# Altium project MDQARM.PrjPcb
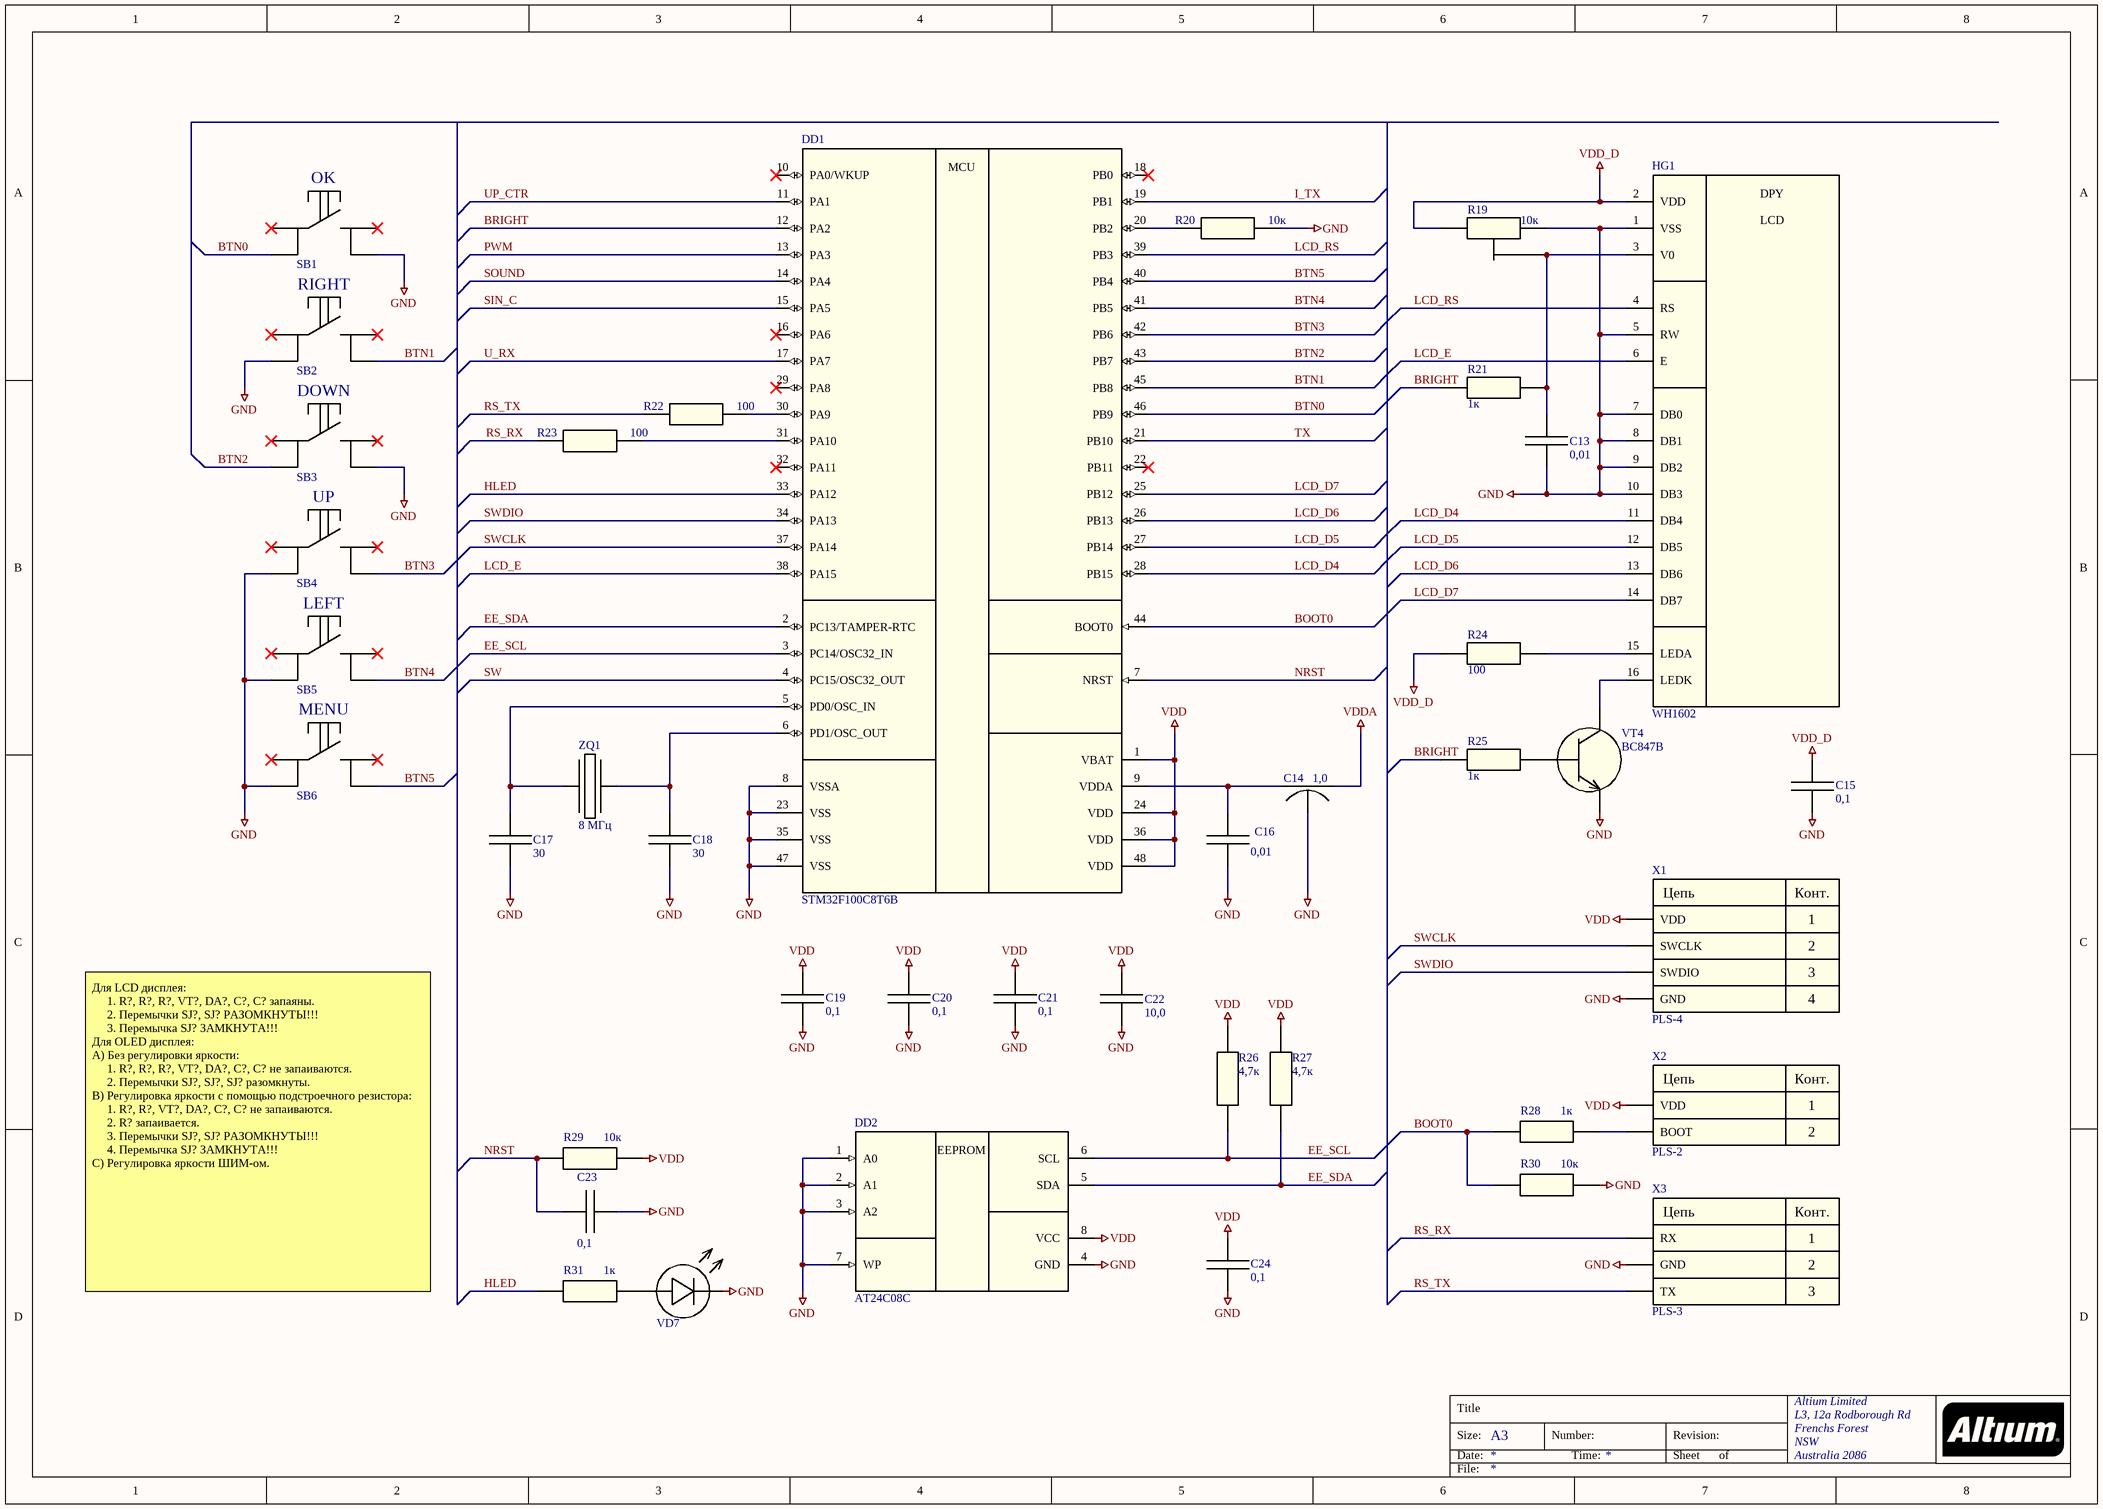
[diagram p0: MDQARM_MCU.SchDoc]
5 sheets, 171 parts. Net scope: global (net labels, ports and power ports of the same name join across sheets).
Board file: MDQARM.PcbDoc
Sheets:
  MDQARM_MCU.SchDoc
  MDQARM_COIL.SchDoc
  MDQARM_SOUND.SchDoc
  MDQARM_USB_UART.SchDoc
  MDQARM_POWER.SchDoc

## Sheet MDQARM_MCU.SchDoc
size A3; Organization: Altium Limited; Address1: L3, 12a Rodborough Rd; Address2: Frenchs Forest; Address3: NSW; Address4: Australia 2086

### Parts
C13  0,01  [Capacitor SMD0805-T0.75]
C14  1,0  [Filter NFM21PC]
C15  0,1  [Capacitor SMD0805-T0.95]
C16  0,01  [Capacitor SMD0805-T0.75]
C17  30  [Capacitor SMD0805-T0.75]
C18  30  [Capacitor SMD0805-T0.75]
C19  0,1  [Capacitor SMD0805-T0.95]
C20  0,1  [Capacitor SMD0805-T0.95]
C21  0,1  [Capacitor SMD0805-T0.95]
C22  10,0  [Capacitor SMD0805-T1.35]
C23  0,1  [Capacitor SMD0805-T0.95]
C24  0,1  [Capacitor SMD0805-T0.95]
DD1  STM32F100C8T6B  [IC STM32F100C8T6B]
DD2  AT24C08C  [IC AT24C08C]
HG1  WH1602  [Indicator WH1602]
R19  10к  [Resistor 3303X-3]
R20  10к  [Resistor SMD0805]
R21  1к  [Resistor SMD0805]
R22  100  [Resistor SMD0805]
R23  100  [Resistor SMD0805]
R24  100  [Resistor SMD0805]
R25  1к  [Resistor SMD0805]
R26  4,7к  [Resistor SMD0805]
R27  4,7к  [Resistor SMD0805]
R28  1к  [Resistor SMD0805]
R29  10к  [Resistor SMD0805]
R30  10к  [Resistor SMD0805]
R31  1к  [Resistor SMD0805]
SB1  KLS7-TS6604-4.3-180  [Button KLS7-TS6604-4.3-180]  (value not drawn)
SB2  KLS7-TS6604-4.3-180  [Button KLS7-TS6604-4.3-180]  (value not drawn)
SB3  KLS7-TS6604-4.3-180  [Button KLS7-TS6604-4.3-180]  (value not drawn)
SB4  KLS7-TS6604-4.3-180  [Button KLS7-TS6604-4.3-180]  (value not drawn)
SB5  KLS7-TS6604-4.3-180  [Button KLS7-TS6604-4.3-180]  (value not drawn)
SB6  KLS7-TS6604-4.3-180  [Button KLS7-TS6604-4.3-180]  (value not drawn)
VD7  RED  [Diode SMD0805]  (value not drawn)
VT4  BC847B  [Transistor SOT23]
X1  PLS-4  [Connector PLS-4]
X2  PLS-2  [Connector PLS-2]
X3  PLS-3  [Connector PLS-3]
ZQ1  8 МГц  [Quartz HC-49SM]

### Nets
GND: C13.1 C14.2 C15.1 C16.1 C17.1 C18.1 C19.1 C20.1 C21.1 C22.1 C23.2 C24.1 DD1.8(VSSA) DD1.23(VSS) DD1.35(VSS) DD1.47(VSS) DD2.1(A0) DD2.2(A1) DD2.3(A2) DD2.4(GND) DD2.7(WP) HG1.1(VSS) HG1.5(RW) HG1.7(DB0) HG1.8(DB1) HG1.9(DB2) HG1.10(DB3) R19.3 R20.2 R30.2 SB1.3 SB2.2 SB3.3 SB4.2 SB5.2 SB6.2 VD7.2(C) VT4.2(E) X1.4(GND) X3.2(GND)
VDD: C19.2 C20.2 C21.2 C22.2 C24.2 DD1.1(VBAT) DD1.24(VDD) DD1.36(VDD) DD1.48(VDD) DD2.8(VCC) R26.2 R27.2 R29.2 X1.1(VDD) X2.1(VDD)
VDD_D: C15.2 HG1.2(VDD) R19.1 R24.2
VDDA: C14.3
BOOT0: DD1.44(BOOT0) R28.1 R30.1
BRIGHT: DD1.12(PA2) R21.1 R25.2
BTN0: DD1.46(PB9) SB1.2
BTN1: DD1.45(PB8) SB2.3
BTN2: DD1.43(PB7) SB3.2
BTN3: DD1.42(PB6) SB4.3
BTN4: DD1.41(PB5) SB5.3
BTN5: DD1.40(PB4) SB6.3
EE_SCL: DD1.3(PC14/OSC32_IN) DD2.6(SCL) R26.1
EE_SDA: DD1.2(PC13/TAMPER-RTC) DD2.5(SDA) R27.1
HLED: DD1.33(PA12) R31.1
I_TX: DD1.19(PB1)
LCD_D4: DD1.28(PB15) HG1.11(DB4)
LCD_D5: DD1.27(PB14) HG1.12(DB5)
LCD_D6: DD1.26(PB13) HG1.13(DB6)
LCD_D7: DD1.25(PB12) HG1.14(DB7)
LCD_E: DD1.38(PA15) HG1.6(E)
LCD_RS: DD1.39(PB3) HG1.4(RS)
NRST: C23.1 DD1.7(NRST) R29.1
PWM: DD1.13(PA3)
RS_RX: R23.1 X3.1(RX)
RS_TX: R22.1 X3.3(TX)
SIN_C: DD1.15(PA5)
SOUND: DD1.14(PA4)
SW: DD1.4(PC15/OSC32_OUT)
SWCLK: DD1.37(PA14) X1.2(SWCLK)
SWDIO: DD1.34(PA13) X1.3(SWDIO)
TX: DD1.21(PB10)
U_RX: DD1.17(PA7)
UP_CTR: DD1.11(PA1)
NetC13_2: C13.2 HG1.3(V0) R19.2 R21.2
NetC14_1: C14.1 C16.2 DD1.9(VDDA)
NetC17_2: C17.2 DD1.5(PD0/OSC_IN) ZQ1.1
NetC18_2: C18.2 DD1.6(PD1/OSC_OUT) ZQ1.2
NetDD1_20: DD1.20(PB2) R20.1
NetDD1_30: DD1.30(PA9) R22.2
NetDD1_31: DD1.31(PA10) R23.2
NetHG1_15: HG1.15(LEDA) R24.1
NetHG1_16: HG1.16(LEDK) VT4.3(C)
NetR25_1: R25.1 VT4.1(B)
NetR28_2: R28.2 X2.2(BOOT)
NetR31_2: R31.2 VD7.1(A)

Not connected (* = marked no-connect by the designer): DD1 10(PA0/WKUP)* 16(PA6)* 18(PB0)* 22(PB11)* 29(PA8)* 32(PA11)*; SB1 1* 4*; SB2 1* 4*; SB3 1* 4*; SB4 1* 4*; SB5 1* 4*; SB6 1* 4*

### Notes on the sheet
- (near SB1) OK
- (near SB1) RIGHT
- (near SB2) DOWN
- (near SB3) UP
- (near SB4) LEFT
- (near SB5) MENU
- Для LCD дисплея:
  1. R?, R?, R?, VT?, DA?, C?, C? запаяны.
  2. Перемычки SJ?, SJ? РАЗОМКНУТЫ!!!
  3. Перемычка SJ? ЗАМКНУТА!!!
  Для OLED дисплея:
  A) Без регулировки яркости:
  1. R?, R?, R?, VT?, DA?, C?, C? не запаиваются.
  2. Перемычки SJ?, SJ?, SJ? разомкнуты.
  B) Регулировка яркости с помощью подстроечного резистора:
  1. R?, R?, VT?, DA?, C?, C? не запаиваются.
  2. R? запаивается.
  3. Перемычки SJ?, SJ? РАЗОМКНУТЫ!!!
  4. Перемычка SJ? ЗАМКНУТА!!!
  C) Регулировка яркости ШИМ-ом.
- Title
- Size:
- Date:
- A3
- Number:
- Time:
- Revision:
- Sheet
- of
- File:
- (in symbol Connector BOOT) Цепь; Конт.
- (in symbol Connector SWD) Цепь; Конт.
- (in symbol Connector UART) Цепь; Конт.
- (in symbol IC AT24C08C) EEPROM
- (in symbol IC STM32F100C8T6B) MCU
- (in symbol Indicator WH1602) DPY; LCD

### Library data of the parts
C13 C16 = Capacitor C0805_10n: Value: 0,01
C14 = Filter NFM21PC105B1С3D: Value: 1,0
C15 C19-C21 C23 C24 = Capacitor C0805_100n: Value: 0,1
C17 C18 = Capacitor C0805_30p: Value: 30
C22 = Capacitor C0805_10u: Value: 10,0
DD1 = IC STM32F100C8T6B: Value: STM32F100C8T6B
DD2 = IC AT24C08C: Value: AT24C08C
HG1 = Indicator WH1602: Value: WH1602
R19 = Resistor 3303X-3-103_10k_25%: Value: 10к
R20 R29 R30 = Resistor R0805_10k_5%: Value: 10к
R21 R25 R28 R31 = Resistor R0805_1k_5%: Value: 1к
R22-R24 = Resistor R0805_100_5%: Value: 100
R26 R27 = Resistor R0805_4.7k_5%: Value: 4,7к
SB1-SB6 = Button KLS7-TS6604-4.3-180: SMD Tact Switch 4.3mm; Value: KLS7-TS6604-4.3-180
VD7 = Diode LED0805RED: LED Red SMD0805
VT4 = Transistor BC847B: Value: BC847B
X1 = Connector SWD: PLS-4 Connector
X2 = Connector BOOT: PLS-2 Connector
X3 = Connector UART: PLS-3 Connector
ZQ1 = Quartz HC-49SM-8MHz: Value: HC-49SM-8MHz

## Sheet MDQARM_COIL.SchDoc
size A3; Organization: Altium Limited; Address1: L3, 12a Rodborough Rd; Address2: Frenchs Forest; Address3: NSW; Address4: Australia 2086
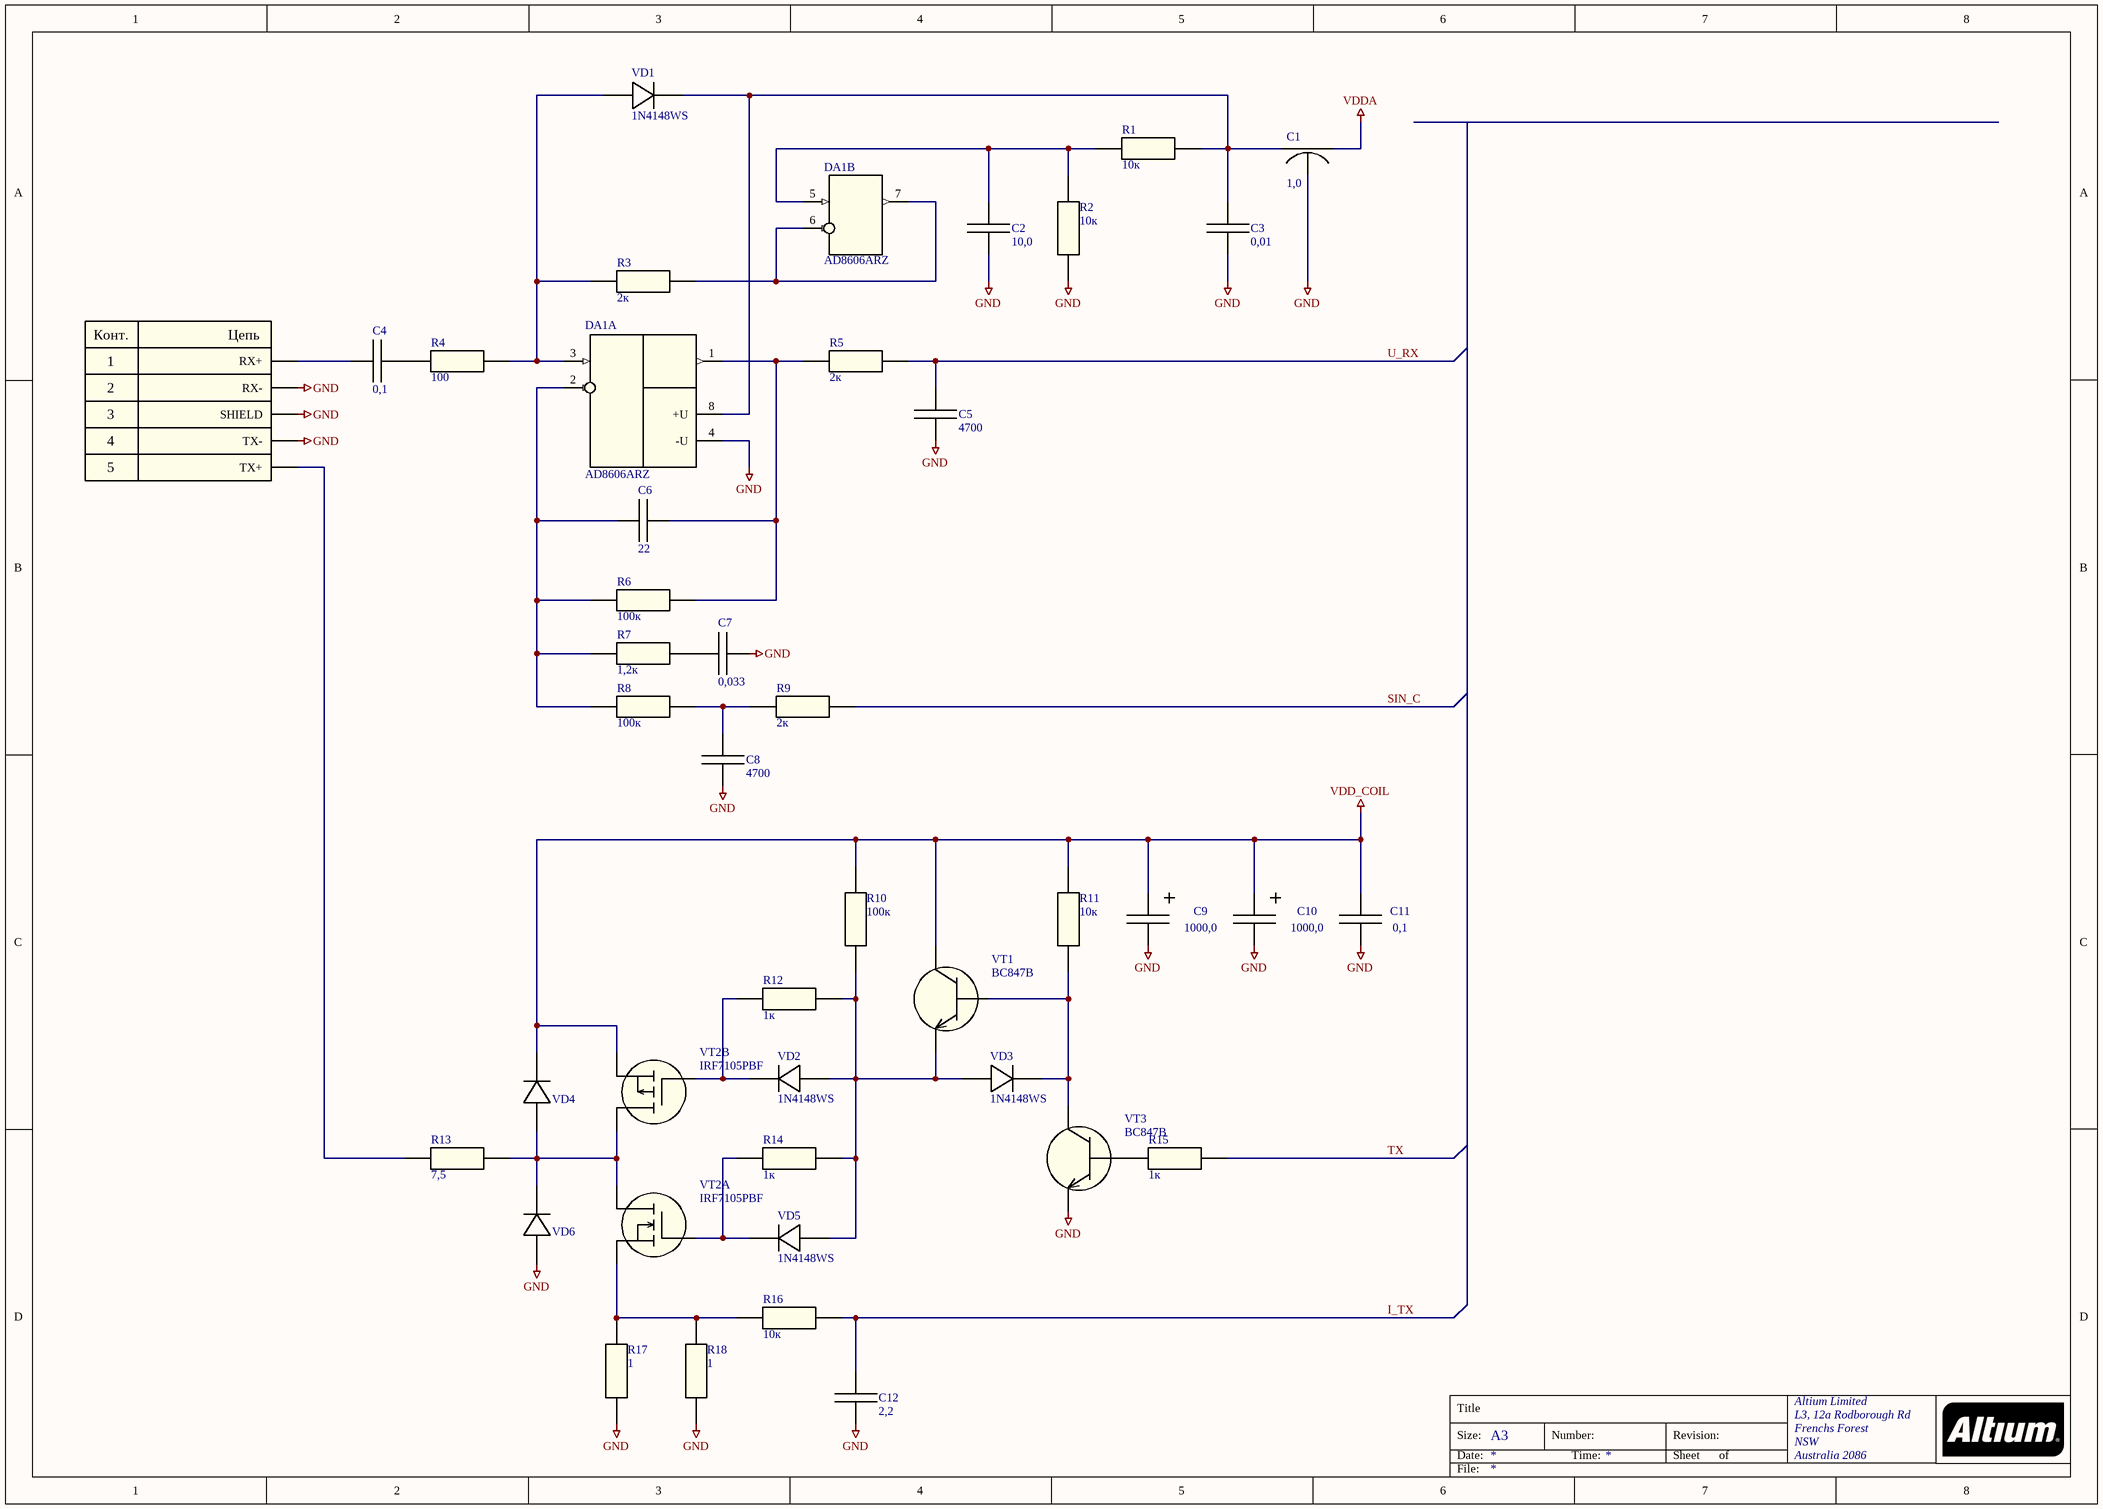
[diagram p1: MDQARM_COIL.SchDoc]

### Parts
*1  Connector MD_COIL  [Connector MD_COIL]  (value not drawn)
C1  1,0  [Filter NFM21PC]
C2  10,0  [Capacitor SMD0805-T1.35]
C3  0,01  [Capacitor SMD0805-T0.75]
C4  0,1  [Capacitor SMD0805_5mm]
C5  4700  [Capacitor SMD0805-T0.75]
C6  22  [Capacitor SMD0805-T0.75]
C7  0,033  [Capacitor SMD0805_5mm]
C8  4700  [Capacitor SMD0805-T0.75]
C9  1000,0  [Capacitor ECAP SMD10x10.5]
C10  1000,0  [Capacitor ECAP SMD10x10.5]
C11  0,1  [Capacitor SMD0805-T0.95]
C12  2,2  [Capacitor SMD0805-T1.35]
DA1  AD8606ARZ  [IC AD8606ARZ]  (parts A,B of 2)
R1  10к  [Resistor SMD0805]
R2  10к  [Resistor SMD0805]
R3  2к  [Resistor SMD0805]
R4  100  [Resistor SMD0805]
R5  2к  [Resistor SMD0805]
R6  100к  [Resistor SMD0805]
R7  1,2к  [Resistor SMD0805]
R8  100к  [Resistor SMD0805]
R9  2к  [Resistor SMD0805]
R10  100к  [Resistor SMD0805]
R11  10к  [Resistor SMD0805]
R12  1к  [Resistor SMD0805]
R13  7,5  [Resistor SMD2512]
R14  1к  [Resistor SMD0805]
R15  1к  [Resistor SMD0805]
R16  10к  [Resistor SMD0805]
R17  1  [Resistor SMD1206]
R18  1  [Resistor SMD1206]
VD1  1N4148WS  [Diode SOD-323]
VD2  1N4148WS  [Diode SOD-323]
VD3  1N4148WS  [Diode SOD-323]
VD4  ES1J  [Diode SMA]  (value not drawn)
VD5  1N4148WS  [Diode SOD-323]
VD6  ES1J  [Diode SMA]  (value not drawn)
VT1  BC847B  [Transistor SOT23]
VT2  IRF7105PBF  [Transisror IRF7105]  (parts A,B of 2)
VT3  BC847B  [Transistor SOT23]

### Nets
GND: *1.2(RX-) *1.3(SHIELD) *1.4(TX-) C1.2 C2.1 C3.1 C5.1 C7.1 C8.1 C9.2 C10.2 C11.2 C12.1 DA1.4(-U) R2.1 R17.1 R18.1 VD6.1(A) VT3.2(E)
VDD_COIL: C9.1 C10.1 C11.1 R10.2 R11.2 VD4.2(C) VT1.3(C) VT2.S2
VDDA: C1.3
I_TX: C12.2 R16.2
SIN_C: R9.1
TX: R15.2
U_RX: C5.2 R5.2
Net*1_1: *1.1(RX+) C4.2
Net*1_5: *1.5(TX+) R13.1
NetC1_1: C1.1 C3.2 DA1.8(+U) R1.2 VD1.2(C)
NetC2_2: C2.2 DA1.5(INB+) R1.1 R2.2
NetC4_1: C4.1 R4.1
NetC6_1: C6.1 DA1.2(-INA) R6.1 R7.1 R8.2
NetC6_2: C6.2 DA1.1(OUTA) R5.1 R6.2
NetC7_2: C7.2 R7.2
NetC8_2: C8.2 R8.1 R9.2
NetDA1_3: DA1.3(+INA) R3.1 R4.2 VD1.1(A)
NetDA1_6: DA1.6(INB-) DA1.7(OUTB) R3.2
NetR10_1: R10.1 R12.2 R14.2 VD2.1(A) VD3.1(A) VD5.1(A) VT1.2(E)
NetR11_1: R11.1 VD3.2(C) VT1.1(B) VT3.3(C)
NetR12_1: R12.1 VD2.2(C) VT2.G2
NetR13_2: R13.2 VD4.1(A) VD6.2(C) VT2.D1 VT2.D2
NetR14_1: R14.1 VD5.2(C) VT2.G1
NetR15_1: R15.1 VT3.1(B)
NetR16_1: R16.1 R17.2 R18.2 VT2.S1

### Notes on the sheet
- Title
- Size:
- Date:
- A3
- Number:
- Time:
- Revision:
- Sheet
- of
- File:
- (in symbol Connector MD_COIL) Конт.; Цепь

### Library data of the parts
C1 = Filter NFM21PC105B1С3D: Value: 1,0
C2 = Capacitor C0805_10u: Value: 10,0
C3 = Capacitor C0805_10n: Value: 0,01
C4 = Capacitor C0805_5mm_100n: Value: 0,1
C5 C8 = Capacitor C0805_4.7n: Value: 4700
C6 = Capacitor C0805_22p: Value: 22
C7 = Capacitor C0805_5mm_33n: Value: 0,033
C9 C10 = Capacitor ECAP SMD 1000uF_6.3V: Value: 1000,0
C11 = Capacitor C0805_100n: Value: 0,1
C12 = Capacitor C0805_2.2u: Value: 2,2
DA1 = IC AD8606ARZ: Value: AD8606ARZ
R1 R2 = Resistor R0805_10k_1%: Value: 10к
R3 = Resistor R0805_2k_1%: Value: 2к
R4 = Resistor R0805_100_1%: Value: 100
R5 R9 = Resistor R0805_2k_5%: Value: 2к
R6 R8 = Resistor R0805_100k_1%: Value: 100к
R7 = Resistor R0805_1.2k_1%: Value: 1,2к
R10 = Resistor R0805_100k_5%: Value: 100к
R11 R16 = Resistor R0805_10k_5%: Value: 10к
R12 R14 R15 = Resistor R0805_1k_5%: Value: 1к
R13 = Resistor R2512_7.5R_5%: Value: 7,5
R17 R18 = Resistor R1206_1R_5%: Value: 1
VD1-VD3 VD5 = Diode 1N4148WS: 150mA 100V 4ns
VD4 VD6 = Diode ES1J: 1A 600V 35ns
VT1 VT3 = Transistor BC847B: Value: BC847B
VT2 = Transistor IRF7105PBF: Value: IRF7105BPF

## Sheet MDQARM_SOUND.SchDoc
size A3; Organization: Altium Limited; Address1: L3, 12a Rodborough Rd; Address2: Frenchs Forest; Address3: NSW; Address4: Australia 2086
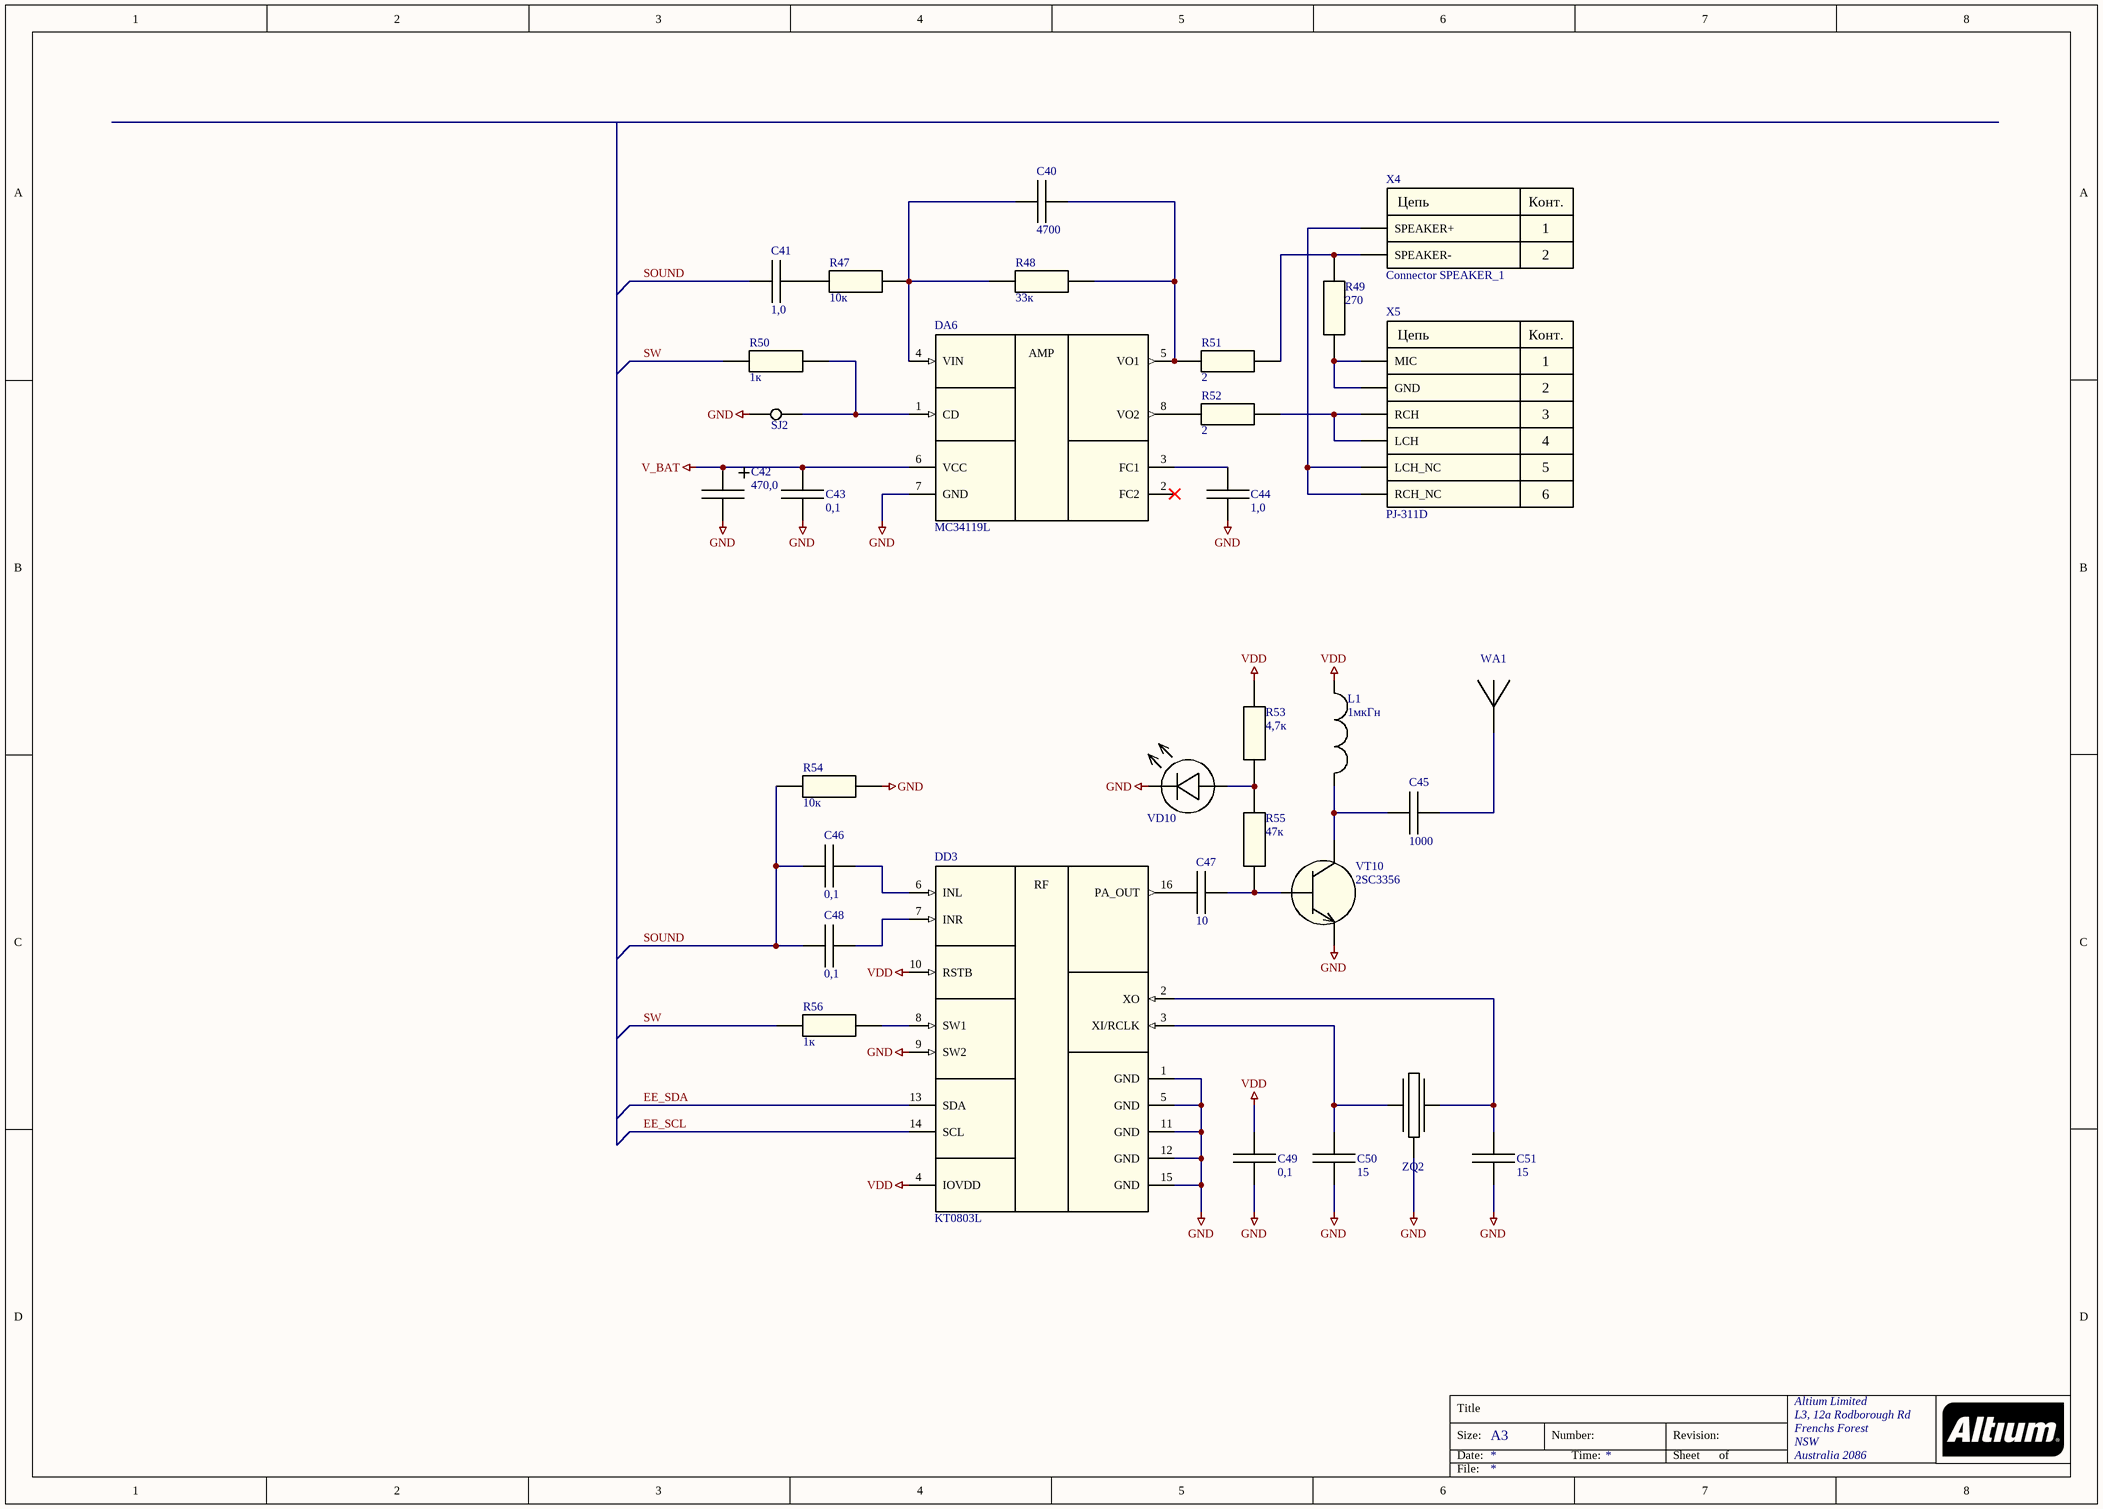
[diagram p2: MDQARM_SOUND.SchDoc]

### Parts
C40  4700  [Capacitor SMD0805-T0.75]
C41  1,0  [Capacitor SMD0805-T1.35]
C42  470,0  [Capacitor ECAP SMD10x10.5]
C43  0,1  [Capacitor SMD0805-T0.95]
C44  1,0  [Capacitor SMD0805-T1.35]
C45  1000  [Capacitor SMD0805-T0.75]
C46  0,1  [Capacitor SMD0805-T0.95]
C47  10  [Capacitor SMD0805-T0.75]
C48  0,1  [Capacitor SMD0805-T0.95]
C49  0,1  [Capacitor SMD0805-T0.95]
C50  15  [Capacitor SMD0805-T0.75]
C51  15  [Capacitor SMD0805-T0.75]
DA6  MC34119L  [IC MC34119L]
DD3  KT0803L  [IC KT0803L]
L1  1мкГн  [Inductor SMD1210]
R47  10к  [Resistor SMD0805]
R48  33к  [Resistor SMD0805]
R49  270  [Resistor SMD0805]
R50  1к  [Resistor SMD0805]
R51  2  [Resistor SMD0805]
R52  2  [Resistor SMD0805]
R53  4,7к  [Resistor SMD0805]
R54  10к  [Resistor SMD0805]
R55  47к  [Resistor SMD0805]
R56  1к  [Resistor SMD0805]
SJ2  SolderJump 1  [SolderJump 1]  (value not drawn)
VD10  RED  [Diode SMD0805]  (value not drawn)
VT10  2SC3356  [Transistor SOT23]
WA1  Antenna 1  [Antenna 1]  (value not drawn)
X4  Connector SPEAKER_1  [Connector SPEAKER]
X5  PJ-311D  [Connector PJ-311D]
ZQ2  32768 Гц  [Quartz DT-38T-32768Hz]  (value not drawn)

### Nets
GND: C42.2 C43.1 C44.1 C49.1 C50.2 C51.2 DA6.7(GND) DD3.1(GND) DD3.5(GND) DD3.9(SW2) DD3.11(GND) DD3.12(GND) DD3.15(GND) R54.2 SJ2.2 VD10.2(C) VT10.2(E) ZQ2.3(GND)
V_BAT: C42.1 C43.2 DA6.6(VCC)
VDD: C49.2 DD3.4(IOVDD) DD3.10(RSTB) L1.1 R53.1
EE_SCL: DD3.14(SCL)
EE_SDA: DD3.13(SDA)
SOUND: C41.1 C46.1 C48.1 R54.1
SW: R50.1 R56.1
NetC40_1: C40.1 DA6.4(VIN) R47.2 R48.1
NetC40_2: C40.2 DA6.5(VO1) R48.2 R51.1
NetC41_2: C41.2 R47.1
NetC44_2: C44.2 DA6.3(FC1)
NetC45_1: C45.1 L1.2 VT10.3(C)
NetC45_2: C45.2 WA1.1
NetC46_2: C46.2 DD3.6(INL)
NetC47_1: C47.1 DD3.16(PA_OUT)
NetC47_2: C47.2 R55.1 VT10.1(B)
NetC48_2: C48.2 DD3.7(INR)
NetC50_1: C50.1 DD3.3(XI/RCLK) ZQ2.1
NetC51_1: C51.1 DD3.2(XO) ZQ2.2
NetDA6_1: DA6.1(CD) R50.2 SJ2.1
NetDA6_8: DA6.8(VO2) R52.1
NetDD3_8: DD3.8(SW1) R56.2
NetR49_1: R49.1 X5.1(MIC) X5.2(GND)
NetR49_2: R49.2 R51.2 X4.2(SPEAKER-)
NetR52_2: R52.2 X5.3(RCH) X5.4(LCH)
NetR53_2: R53.2 R55.2 VD10.1(A)
NetX4_1: X4.1(SPEAKER+) X5.5(LCH_NC) X5.6(RCH_NC)

Not connected (* = marked no-connect by the designer): DA6 2(FC2)*

### Notes on the sheet
- Title
- Size:
- Date:
- A3
- Number:
- Time:
- Revision:
- Sheet
- of
- File:
- (in symbol Connector PJ-311D) Цепь; Конт.
- (in symbol Connector SPEAKER_1) Цепь; Конт.
- (in symbol IC KT0803L) RF
- (in symbol IC MC34119L) AMP

### Library data of the parts
C40 = Capacitor C0805_4.7n: Value: 4700
C41 C44 = Capacitor C0805_1u: Value: 1,0
C42 = Capacitor ECAP SMD 470uF_16V: Value: 470,0
C43 C46 C48 C49 = Capacitor C0805_100n: Value: 0,1
C45 = Capacitor C0805_1n: Value: 1000
C47 = Capacitor C0805_10p: Value: 10
C50 C51 = Capacitor C0805_15p: Value: 15
DA6 = IC MC34119L: Value: MC34119L
DD3 = IC KT0803L: Value: KT0803L
L1 = Inductance L1210_1uH: Value: 1мкГн
R47 R54 = Resistor R0805_10k_5%: Value: 10к
R48 = Resistor R0805_33k_5%: Value: 33к
R49 = Resistor R0805_270R_5%: Value: 270
R50 R56 = Resistor R0805_1k_5%: Value: 1к
R51 R52 = Resistor R0805_2R_5%: Value: 2
R53 = Resistor R0805_4.7k_5%: Value: 4,7к
R55 = Resistor R0805_47k_5%: Value: 47к
VD10 = Diode LED0805RED: LED Red SMD0805
VT10 = Transistor 2SC3356: Value: 2SC3356
X5 = Connector PJ-311D: Audio Jack 3.5mm; Value: PJ-311D
ZQ2 = Quartz DT-38T-32768Hz: Value: DT-38T-32768Hz

## Sheet MDQARM_USB_UART.SchDoc
size A3; Organization: Altium Limited; Address1: L3, 12a Rodborough Rd; Address2: Frenchs Forest; Address3: NSW; Address4: Australia 2086
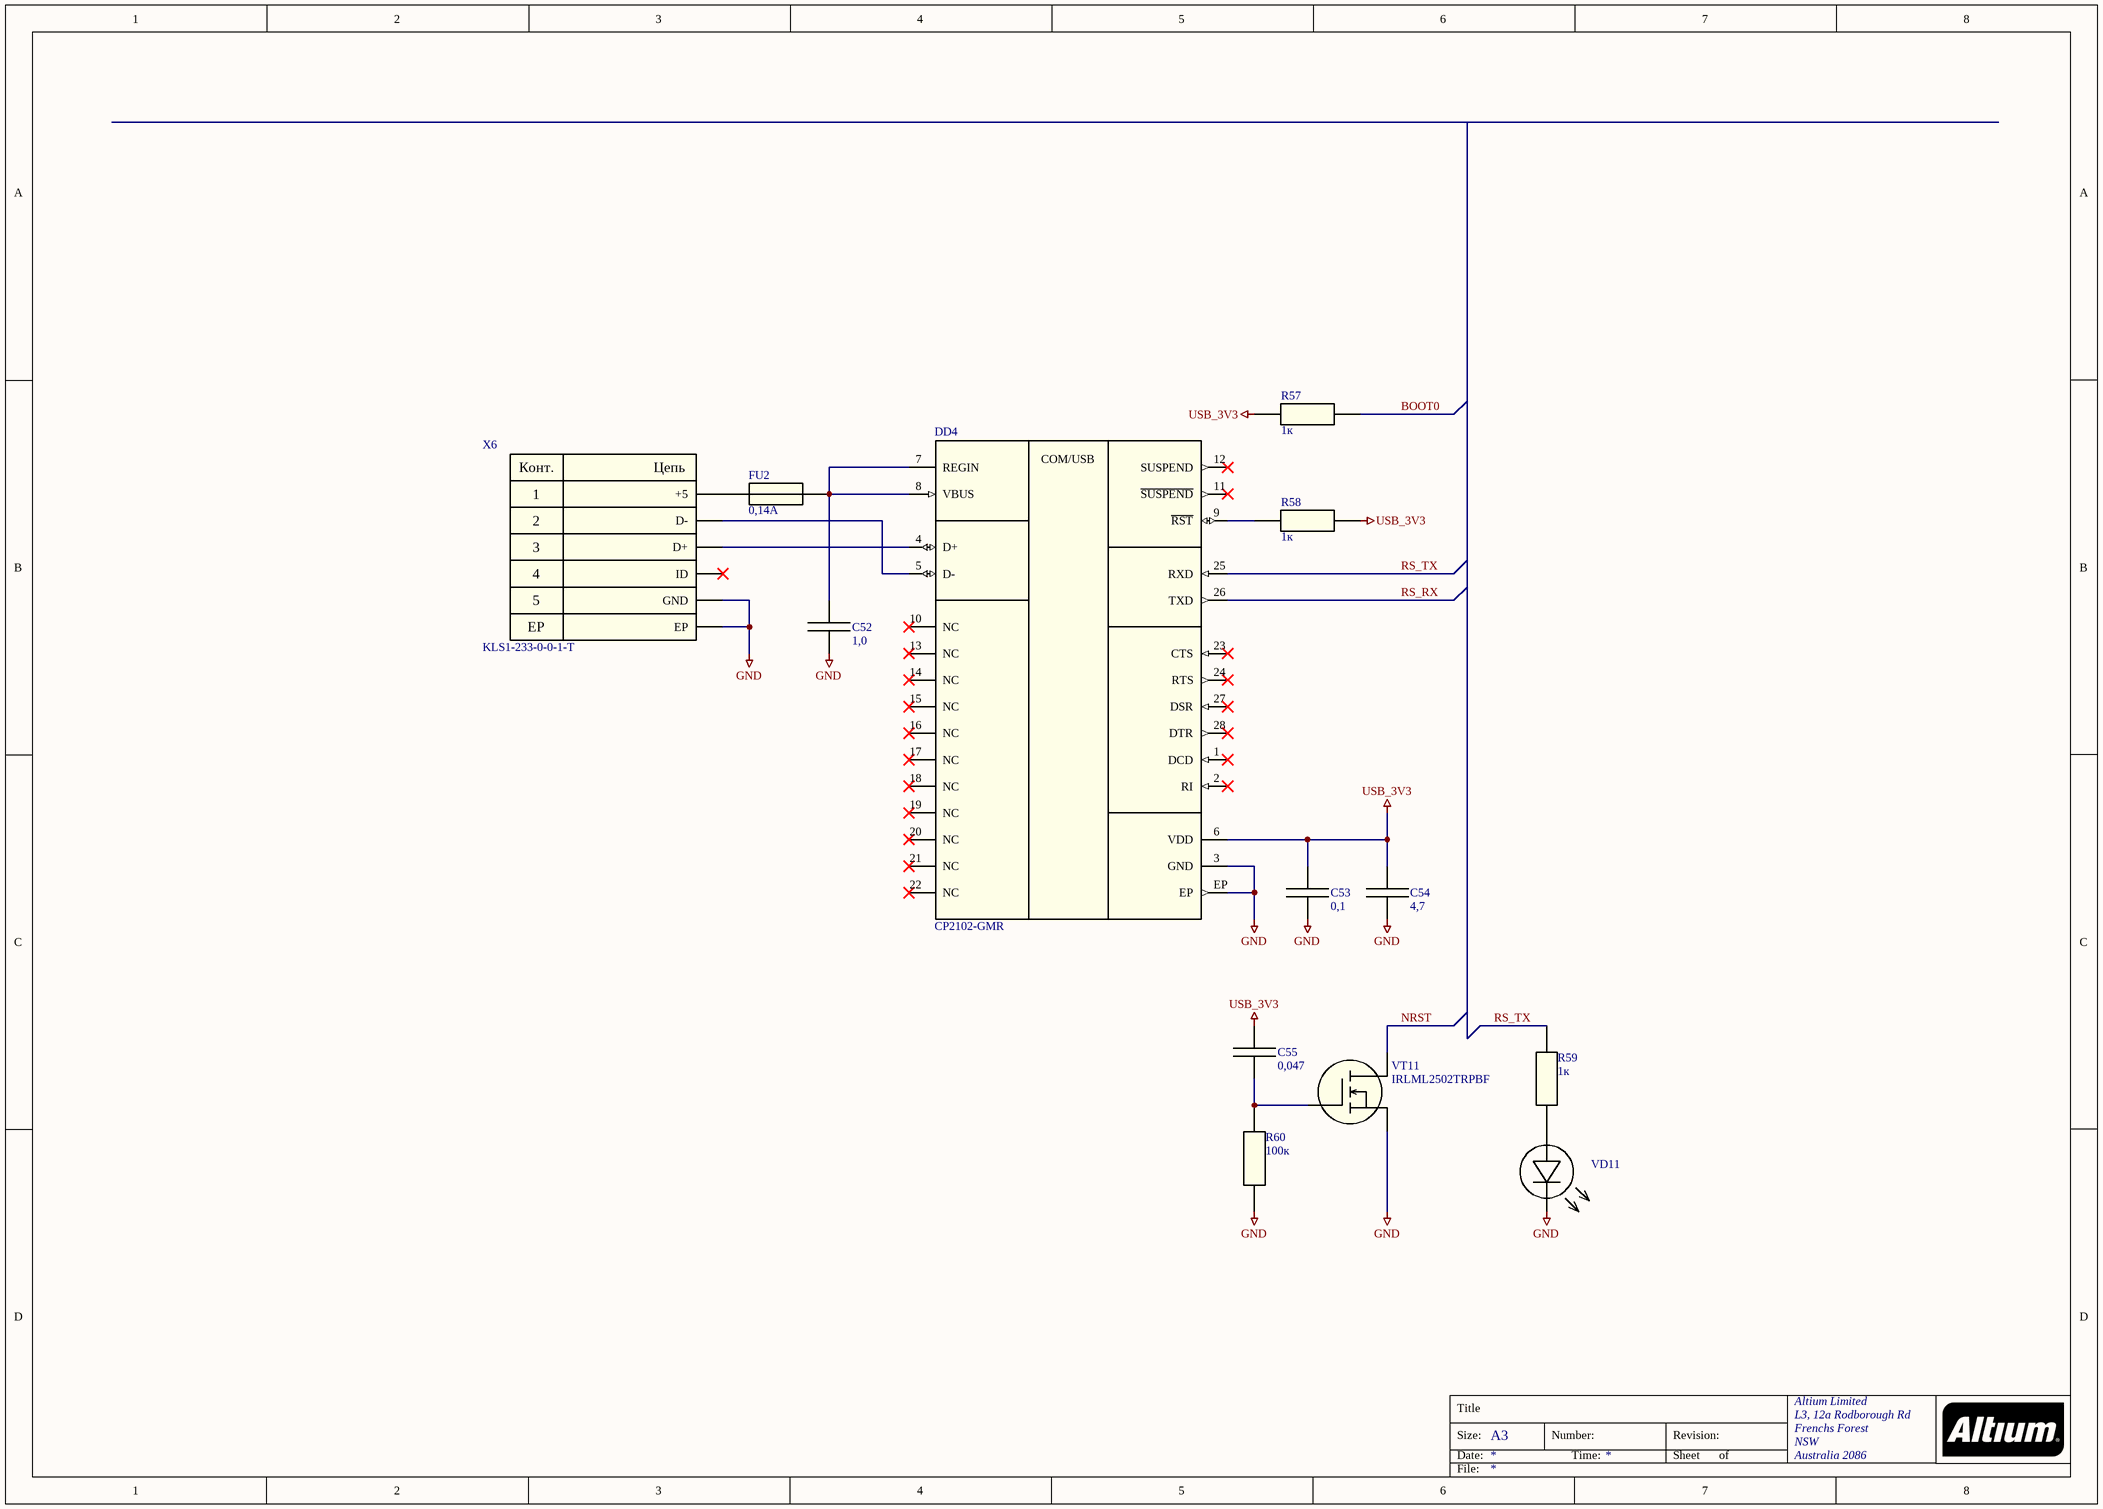
[diagram p3: MDQARM_USB_UART.SchDoc]

### Parts
C52  1,0  [Capacitor SMD0805-T1.35]
C53  0,1  [Capacitor SMD0805-T0.95]
C54  4,7  [Capacitor SMD0805-T1.35]
C55  0,047  [Capacitor SMD0805-T0.75]
DD4  CP2102-GMR  [IC CP2102-GMR]
FU2  0,14А  [Fuse MF-NSMF]
R57  1к  [Resistor SMD0805]
R58  1к  [Resistor SMD0805]
R59  1к  [Resistor SMD0805]
R60  100к  [Resistor SMD0805]
VD11  GREEN  [Diode SMD0805]  (value not drawn)
VT11  IRLML2502TRPBF  [Transistor SOT23]
X6  KLS1-233-0-0-1-T  [Connector KLS1-233-0-0-1-T]

### Nets
GND: C52.1 C53.1 C54.1 DD4.3(GND) DD4.EP R60.1 VD11.2(C) VT11.2(S) X6.5(GND) X6.EP
USB_3V3: C53.2 C54.2 C55.2 DD4.6(VDD) R57.2 R58.2
BOOT0: R57.1
NRST: VT11.3(D)
RS_RX: DD4.26(TXD)
RS_TX: DD4.25(RXD) R59.1
NetC52_2: C52.2 DD4.7(REGIN) DD4.8(VBUS) FU2.2
NetC55_1: C55.1 R60.2 VT11.1(G)
NetDD4_4: DD4.4(D+) X6.3(D+)
NetDD4_5: DD4.5(D-) X6.2(D-)
NetDD4_9: DD4.9(~{RST}) R58.1
NetFU2_1: FU2.1 X6.1(+5)
NetR59_2: R59.2 VD11.1(A)

Not connected (* = marked no-connect by the designer): DD4 1(DCD)* 2(RI)* 10(NC)* 11(~{SUSPEND})* 12(SUSPEND)* 13(NC)* 14(NC)* 15(NC)* 16(NC)* 17(NC)* 18(NC)* 19(NC)* 20(NC)* 21(NC)* 22(NC)* 23(CTS)* 24(RTS)* 27(DSR)* 28(DTR)*; X6 4(ID)*

### Notes on the sheet
- Title
- Size:
- Date:
- A3
- Number:
- Time:
- Revision:
- Sheet
- of
- File:
- (in symbol Connector KLS1-233-0-0-1-T) Конт.; Цепь
- (in symbol IC CP2102-GMR) COM/USB

### Library data of the parts
C52 = Capacitor C0805_1u: Value: 1,0
C53 = Capacitor C0805_100n: Value: 0,1
C54 = Capacitor C0805_4.7u: Value: 4,7
C55 = Capacitor C0805_47n: Value: 0,047
DD4 = IC CP2102-GMR: Value: CP2102-GMR
FU2 = Fuse MF-NSMF014-2: Value: 0,14А
R57-R59 = Resistor R0805_1k_5%: Value: 1к
R60 = Resistor R0805_100k_5%: Value: 100к
VD11 = Diode LED0805GREEN: LED Green SMD0805
VT11 = Transistor IRLML2502TRPBF: Value: IRLML2502TRPBF
X6 = Connector KLS1-233-0-0-1-T: microUSB Connector

## Sheet MDQARM_POWER.SchDoc
size A3; Organization: Altium Limited; Address1: L3, 12a Rodborough Rd; Address2: Frenchs Forest; Address3: NSW; Address4: Australia 2086
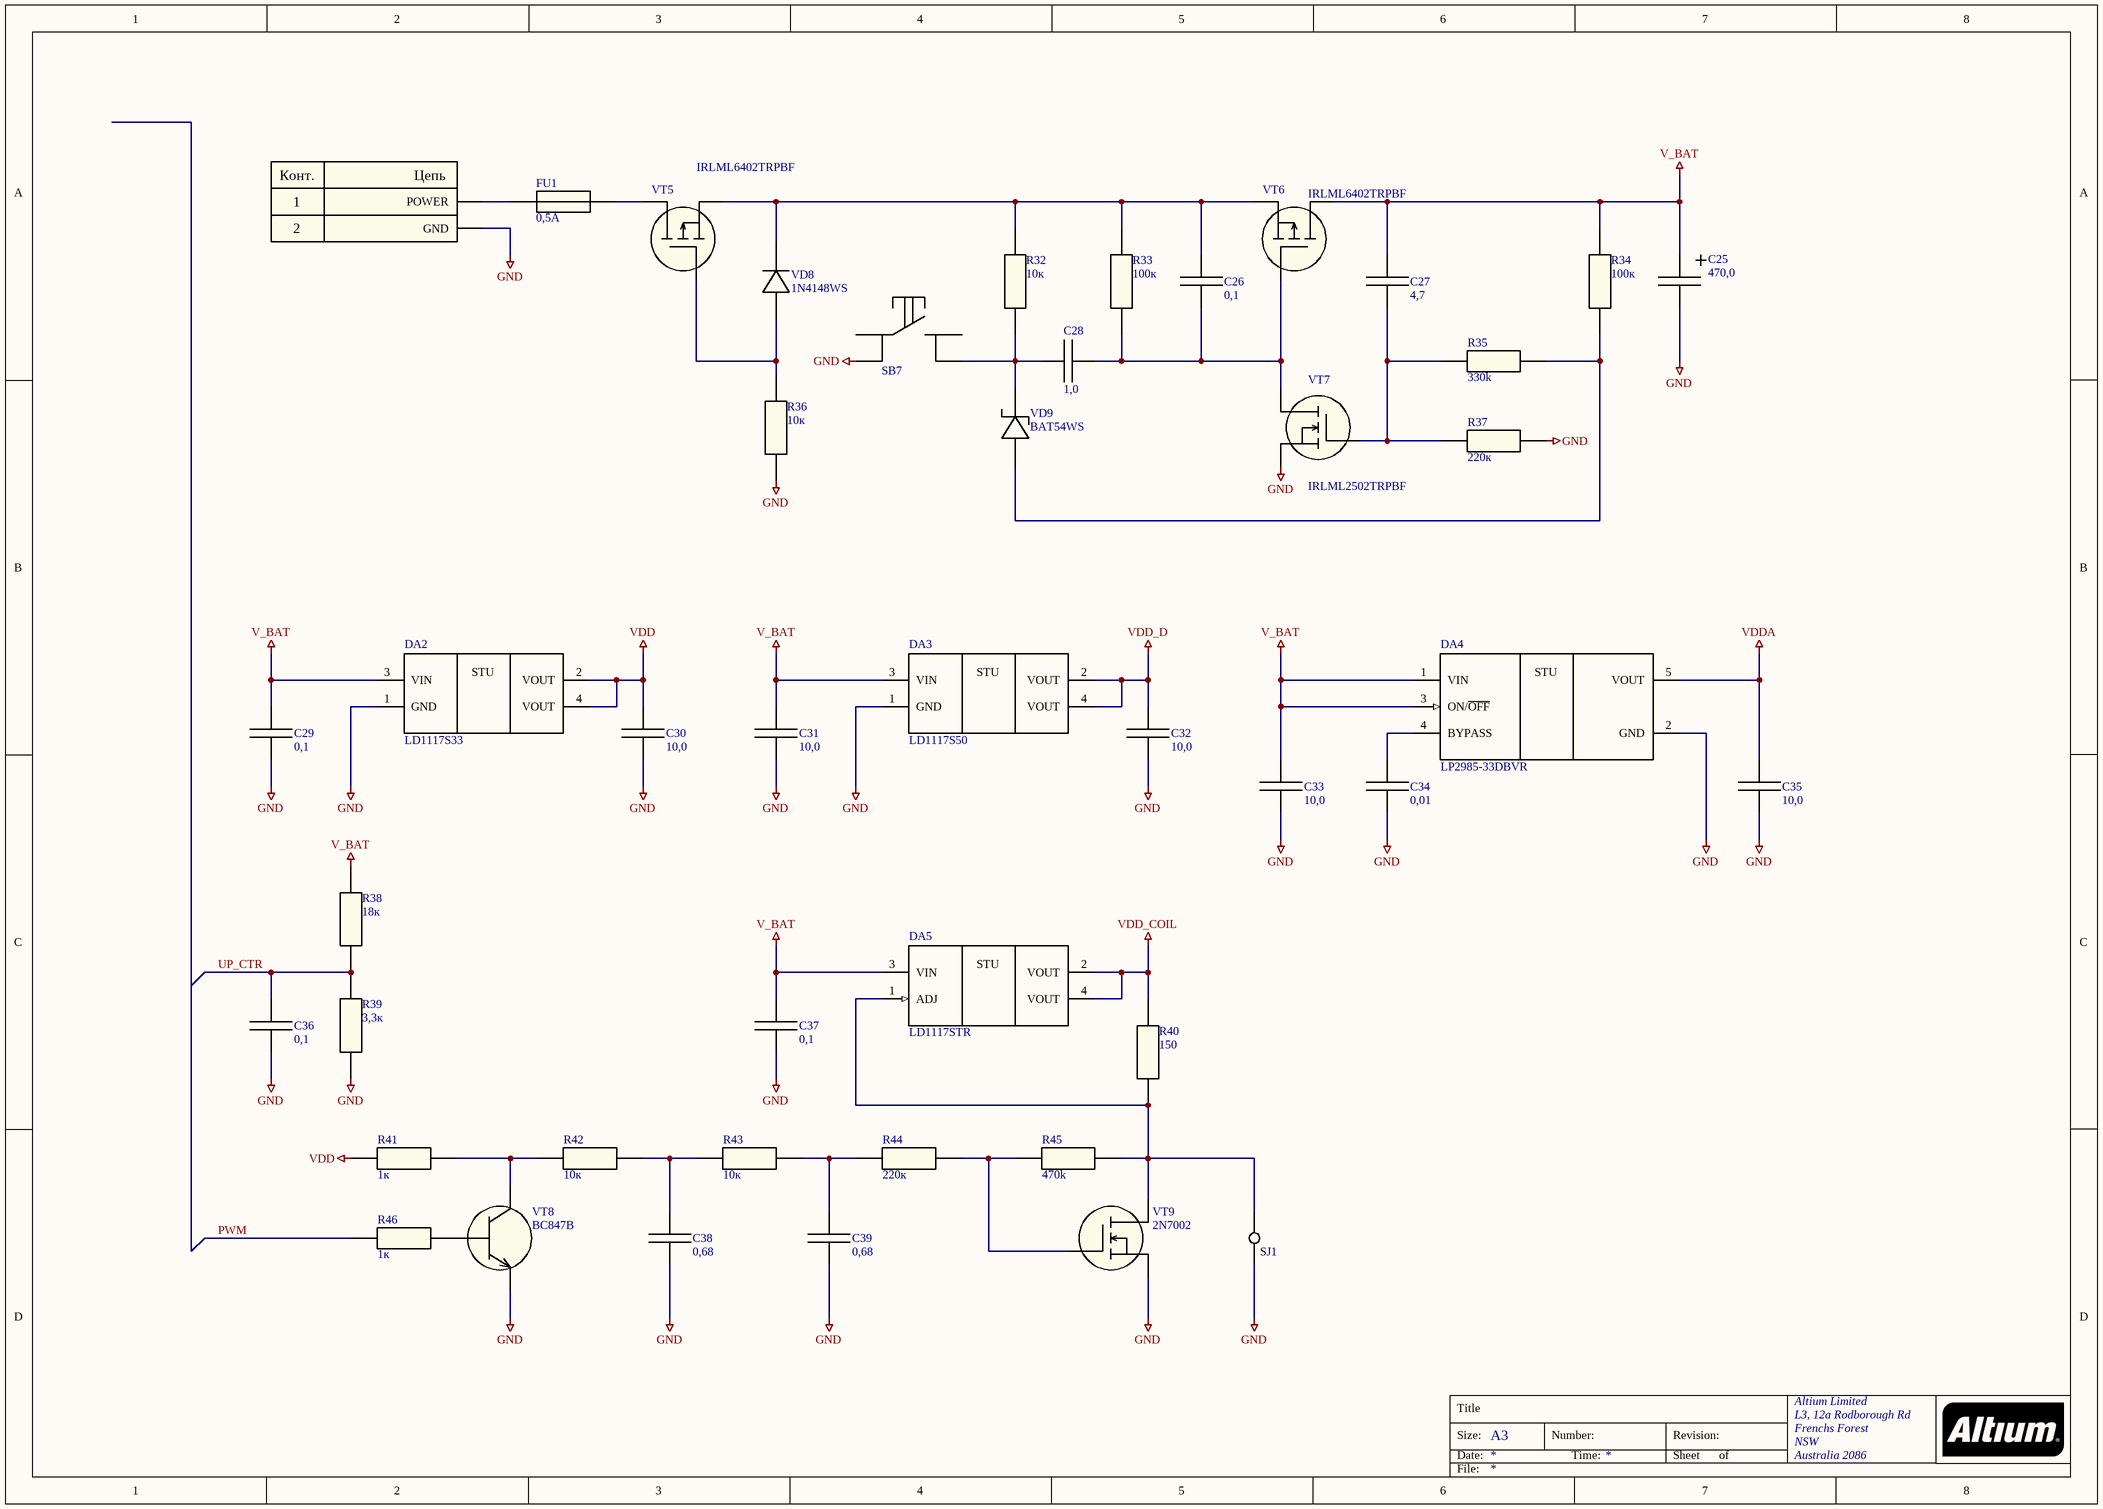
[diagram p4: MDQARM_POWER.SchDoc]

### Parts
*2  Connector MD_POWER  [Connector MD_POWER]  (value not drawn)
C25  470,0  [Capacitor ECAP SMD10x10.5]
C26  0,1  [Capacitor SMD0805-T0.95]
C27  4,7  [Capacitor SMD0805-T1.35]
C28  1,0  [Capacitor SMD0805-T1.35]
C29  0,1  [Capacitor SMD0805-T0.95]
C30  10,0  [Capacitor SMD0805-T1.35]
C31  10,0  [Capacitor SMD0805-T1.35]
C32  10,0  [Capacitor SMD0805-T1.35]
C33  10,0  [Capacitor SMD0805-T1.35]
C34  0,01  [Capacitor SMD0805-T0.75]
C35  10,0  [Capacitor SMD0805-T1.35]
C36  0,1  [Capacitor SMD0805-T0.95]
C37  0,1  [Capacitor SMD0805-T0.95]
C38  0,68  [Capacitor SMD0805-T0.95]
C39  0,68  [Capacitor SMD0805-T0.95]
DA2  LD1117S33  [IC LD1117S33]
DA3  LD1117S50  [IC LD1117S50]
DA4  LP2985-33DBVR  [IC LP2985-33DBVR]
DA5  LD1117STR  [IC LD1117STR]
FU1  0,5А  [Fuse MF-NSMF]
R32  10к  [Resistor SMD0805]
R33  100к  [Resistor SMD0805]
R34  100к  [Resistor SMD0805]
R35  330k  [Resistor SMD0805]
R36  10к  [Resistor SMD0805]
R37  220к  [Resistor SMD0805]
R38  18к  [Resistor SMD0805]
R39  3,3к  [Resistor SMD0805]
R40  150  [Resistor SMD0805]
R41  1к  [Resistor SMD0805]
R42  10к  [Resistor SMD0805]
R43  10к  [Resistor SMD0805]
R44  220к  [Resistor SMD0805]
R45  470k  [Resistor SMD0805]
R46  1к  [Resistor SMD0805]
SB7  KLS7-TS6604-4.3-180  [Button KLS7-TS6604-4.3-180]  (value not drawn)
SJ1  SolderJump 1  [SolderJump 1]  (value not drawn)
VD8  1N4148WS  [Diode SOD-323]
VD9  BAT54WS  [Diode SOD-323]
VT5  IRLML6402TRPBF  [Transistor SOT23]
VT6  IRLML6402TRPBF  [Transistor SOT23]
VT7  IRLML2502TRPBF  [Transistor SOT23]
VT8  BC847B  [Transistor SOT23]
VT9  2N7002  [Transistor SOT23]

### Nets
GND: *2.2(GND) C25.2 C29.1 C30.1 C31.1 C32.1 C33.1 C34.1 C35.1 C36.1 C37.1 C38.1 C39.1 DA2.1(GND) DA3.1(GND) DA4.2(GND) R36.1 R37.2 R39.1 SB7.2 SJ1.1 VT7.2(S) VT8.2(E) VT9.2(S)
V_BAT: C25.1 C27.2 C29.2 C31.2 C33.2 C37.2 DA2.3(VIN) DA3.3(VIN) DA4.1(VIN) DA4.3(ON/~{OFF}) DA5.3(VIN) R34.2 R38.2 VT6.3(D)
VDD: C30.2 DA2.2(VOUT) DA2.4(VOUT) R41.1
VDD_COIL: DA5.2(VOUT) DA5.4(VOUT) R40.1
VDD_D: C32.2 DA3.2(VOUT) DA3.4(VOUT)
VDDA: C35.2 DA4.5(VOUT)
PWM: R46.1
UP_CTR: C36.2 R38.1 R39.2
Net*2_1: *2.1(POWER) FU1.1
NetC26_1: C26.1 C28.2 R33.1 VT6.1(G) VT7.3(D)
NetC26_2: C26.2 R32.2 R33.2 VD8.2(C) VT5.2(S) VT6.2(S)
NetC27_1: C27.1 R35.1 R37.1 VT7.1(G)
NetC28_1: C28.1 R32.1 SB7.3 VD9.2(C)
NetC34_2: C34.2 DA4.4(BYPASS)
NetC38_2: C38.2 R42.2 R43.1
NetC39_2: C39.2 R43.2 R44.1
NetDA5_1: DA5.1(ADJ) R40.2 R45.2 SJ1.2 VT9.3(D)
NetFU1_2: FU1.2 VT5.3(D)
NetR34_1: R34.1 R35.2 VD9.1(A)
NetR36_2: R36.2 VD8.1(A) VT5.1(G)
NetR41_2: R41.2 R42.1 VT8.3(C)
NetR44_2: R44.2 R45.1 VT9.1(G)
NetR46_2: R46.2 VT8.1(B)

Not connected (* = marked no-connect by the designer): SB7 1 4

### Notes on the sheet
- Title
- Size:
- Date:
- A3
- Number:
- Time:
- Revision:
- Sheet
- of
- File:
- (in symbol Connector MD_POWER) Конт.; Цепь
- (in symbol IC LD1117S33) STU
- (in symbol IC LD1117S50) STU
- (in symbol IC LD1117STR) STU
- (in symbol IC LP2985-33DBVR) STU

### Library data of the parts
C25 = Capacitor ECAP SMD 470uF_16V: Value: 470,0
C26 C29 C36 C37 = Capacitor C0805_100n: Value: 0,1
C27 = Capacitor C0805_4.7u: Value: 4,7
C28 = Capacitor C0805_1u: Value: 1,0
C30-C33 C35 = Capacitor C0805_10u: Value: 10,0
C34 = Capacitor C0805_10n: Value: 0,01
C38 C39 = Capacitor C0805_680n: Value: 0,68
DA2 = IC LD1117S33: Value: LD1117S33
DA3 = IC LD1117S50: Value: LD1117S50
DA4 = IC LP2985-33DBVR: Value: LP2985-33DBVR
DA5 = IC LD1117STR: Value: LD1117STR
FU1 = Fuse MF-NSMF050-2: Value: 0,5А
R32 R36 R42 R43 = Resistor R0805_10k_5%: Value: 10к
R33 R34 = Resistor R0805_100k_5%: Value: 100к
R35 = Resistor R0805_330k_5%: Value: 330к
R37 R44 = Resistor R0805_220k_5%: Value: 220к
R38 = Resistor R0805_18k_5%: Value: 18к
R39 = Resistor R0805_3.3k_5%: Value: 3,3к
R40 = Resistor R0805_150_5%: Value: 150
R41 R46 = Resistor R0805_1k_5%: Value: 1к
R45 = Resistor R0805_470k_5%: Value: 470к
SB7 = Button KLS7-TS6604-4.3-180: SMD Tact Switch 4.3mm; Value: KLS7-TS6604-4.3-180
VD8 = Diode 1N4148WS: 150mA 100V 4ns
VD9 = Diode BAT54WS: 200mA 30V Schottky
VT5 VT6 = Transistor IRLML6402TRPBF: Value: IRLML6402TRPBF
VT7 = Transistor IRLML2502TRPBF: Value: IRLML2502TRPBF
VT8 = Transistor BC847B: Value: BC847B
VT9 = Transistor 2N7002: Value: 2N7002

## Nets that join several sheets
GND: MDQARM_MCU (40 pins), MDQARM_COIL (19 pins), MDQARM_SOUND (18 pins), MDQARM_USB_UART (10 pins), MDQARM_POWER (24 pins)
V_BAT: MDQARM_SOUND (C42.1 C43.2 DA6.6), MDQARM_POWER (14 pins)
VDD: MDQARM_MCU (15 pins), MDQARM_SOUND (5 pins), MDQARM_POWER (C30.2 DA2.2 DA2.4 R41.1)
VDD_COIL: MDQARM_COIL (8 pins), MDQARM_POWER (DA5.2 DA5.4 R40.1)
VDD_D: MDQARM_MCU (C15.2 HG1.2 R19.1 R24.2), MDQARM_POWER (C32.2 DA3.2 DA3.4)
VDDA: MDQARM_MCU (C14.3), MDQARM_COIL (C1.3), MDQARM_POWER (C35.2 DA4.5)
BOOT0: MDQARM_MCU (DD1.44 R28.1 R30.1), MDQARM_USB_UART (R57.1)
EE_SCL: MDQARM_MCU (DD1.3 DD2.6 R26.1), MDQARM_SOUND (DD3.14)
EE_SDA: MDQARM_MCU (DD1.2 DD2.5 R27.1), MDQARM_SOUND (DD3.13)
I_TX: MDQARM_MCU (DD1.19), MDQARM_COIL (C12.2 R16.2)
NRST: MDQARM_MCU (C23.1 DD1.7 R29.1), MDQARM_USB_UART (VT11.3)
PWM: MDQARM_MCU (DD1.13), MDQARM_POWER (R46.1)
RS_RX: MDQARM_MCU (R23.1 X3.1), MDQARM_USB_UART (DD4.26)
RS_TX: MDQARM_MCU (R22.1 X3.3), MDQARM_USB_UART (DD4.25 R59.1)
SIN_C: MDQARM_MCU (DD1.15), MDQARM_COIL (R9.1)
SOUND: MDQARM_MCU (DD1.14), MDQARM_SOUND (C41.1 C46.1 C48.1 R54.1)
SW: MDQARM_MCU (DD1.4), MDQARM_SOUND (R50.1 R56.1)
TX: MDQARM_MCU (DD1.21), MDQARM_COIL (R15.2)
U_RX: MDQARM_MCU (DD1.17), MDQARM_COIL (C5.2 R5.2)
UP_CTR: MDQARM_MCU (DD1.11), MDQARM_POWER (C36.2 R38.1 R39.2)